# Altium project DS-1+.PrjPcb
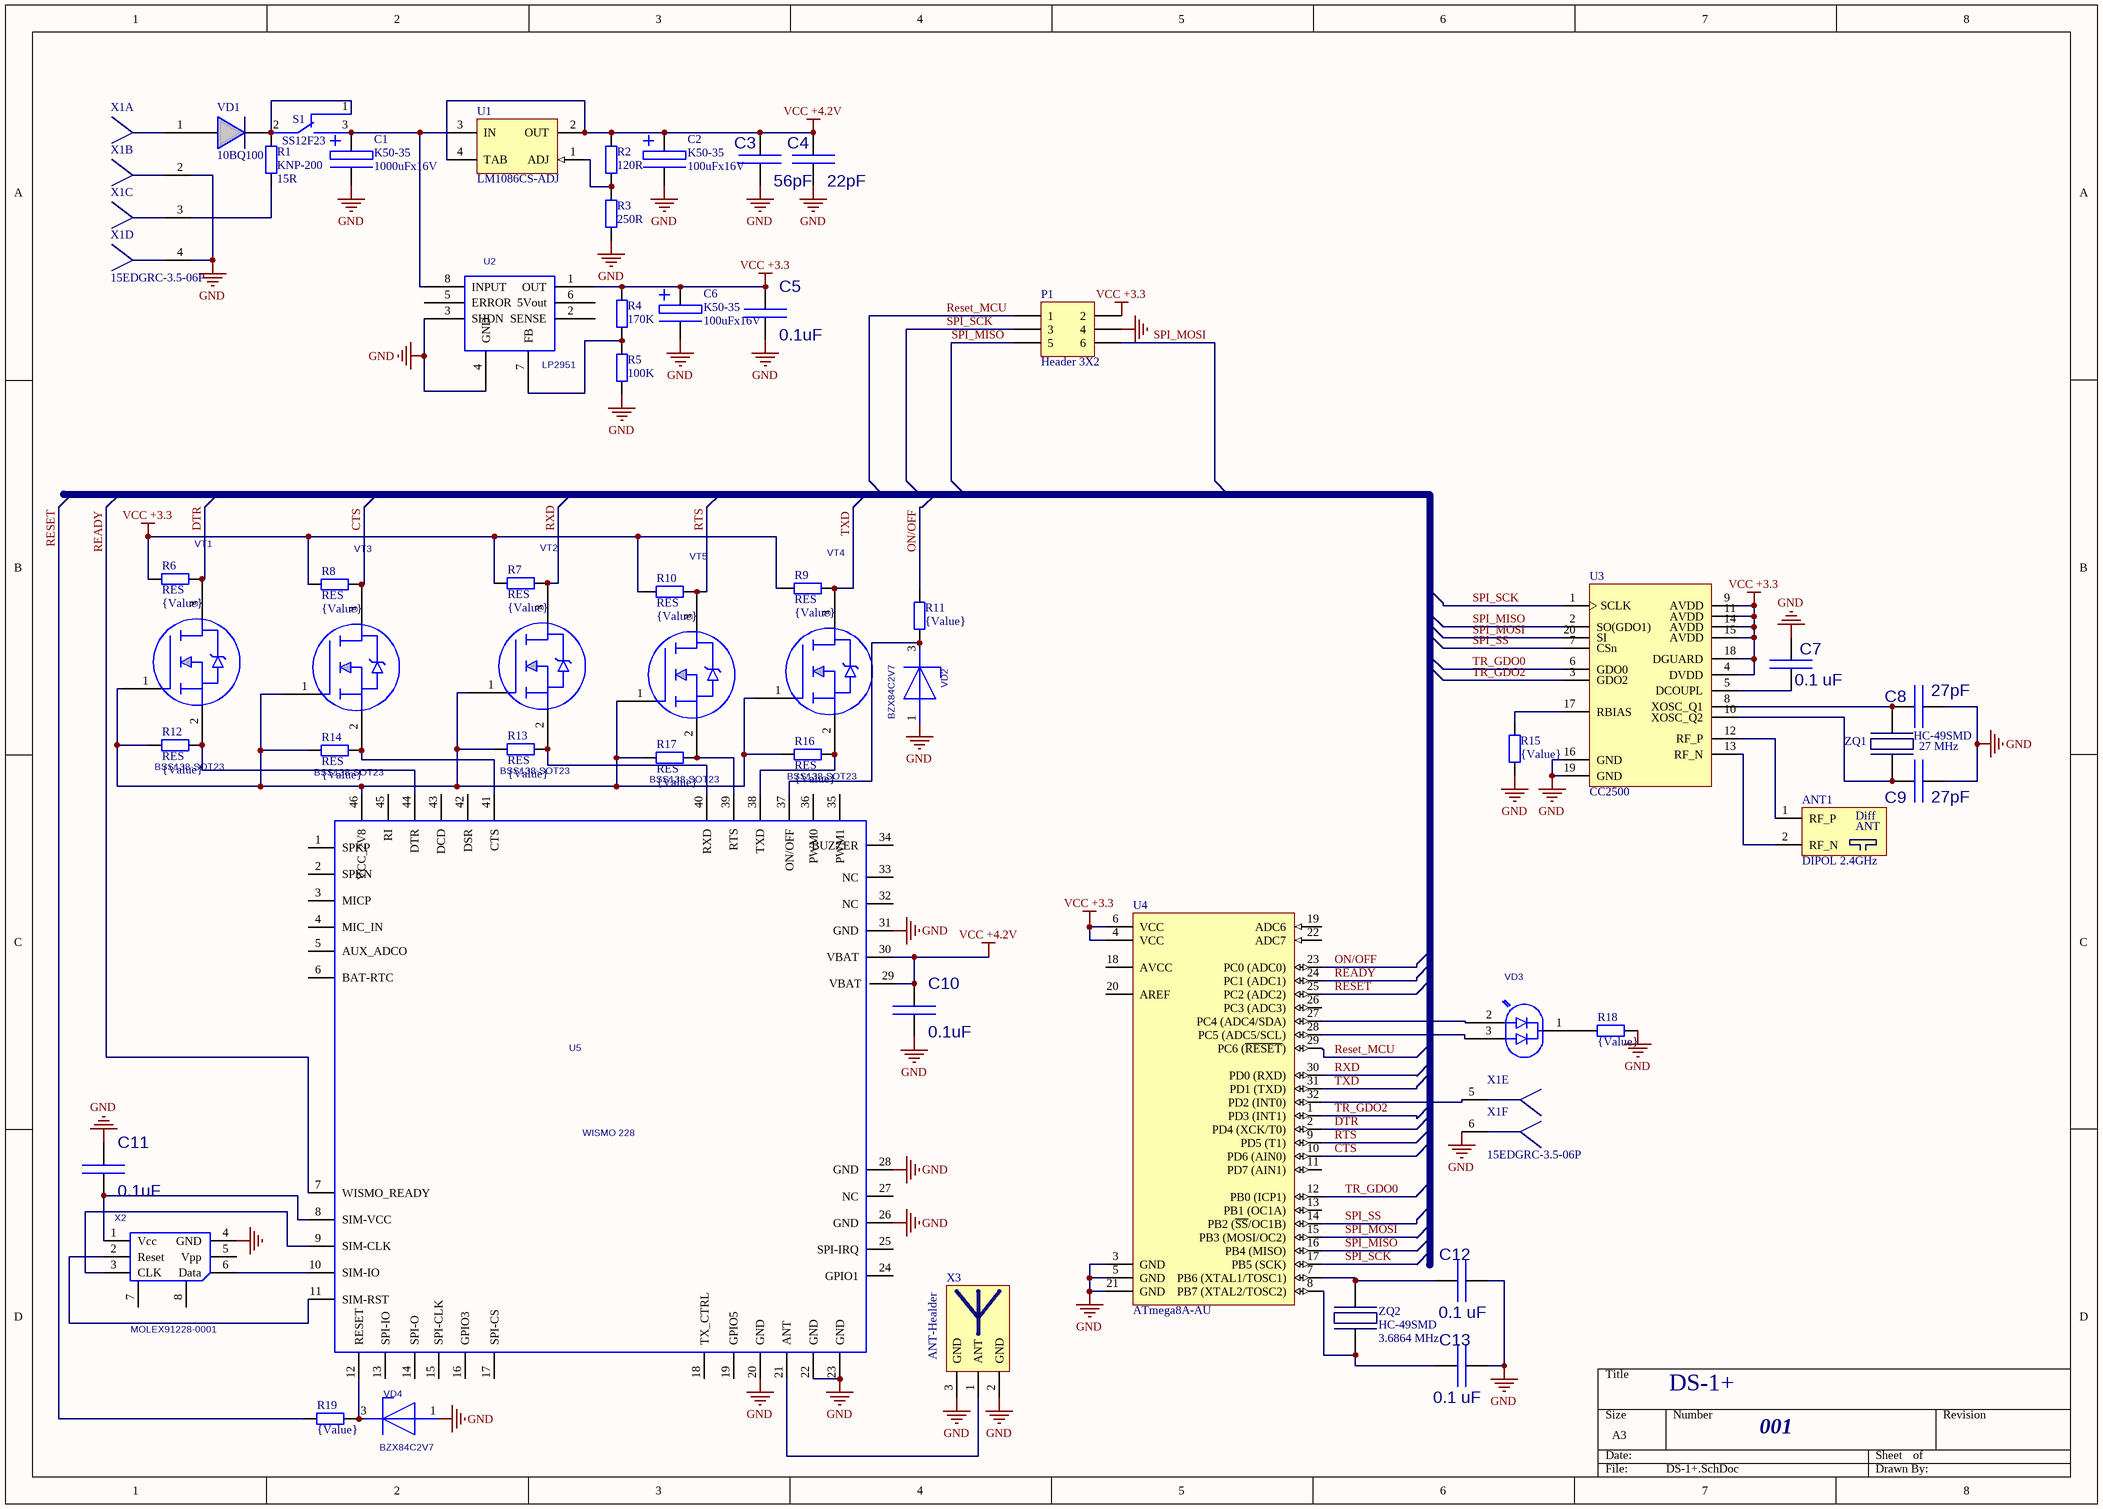
[diagram p0: DS-1+.SchDoc]
1 sheet, 54 parts. Net scope: global (net labels, ports and power ports of the same name join across sheets).
Board file: DS-1+.PcbDoc

## Sheet DS-1+.SchDoc
size A3

### Parts
ANT1  DIPOL 2.4GHz  [ANT_Dipol_2.4GHz]
C1  K50-35  value 1000uFx16V  [CAP_POL_D10]
C2  K50-35  value 100uFx16V  [CAP_POL_D6.3]
C3  value 56pF  [C0805]  (hidden comment: KONDENS_SMD)
C4  value 22pF  [C0805]  (hidden comment: KONDENS_SMD)
C5  value 0.1uF  [C0805]  (hidden comment: KONDENS_SMD)
C6  K50-35  value 100uFx16V  [CAP_POL_D6.3]
C7  value 0.1 uF  [C0805]  (hidden comment: KONDENS_SMD)
C8  value 27pF  [C0805]  (hidden comment: KONDENS_SMD)
C9  value 27pF  [C0805]  (hidden comment: KONDENS_SMD)
C10  value 0.1uF  [C0805]  (hidden comment: KONDENS_SMD)
C11  value 0.1uF  [C0805]  (hidden comment: KONDENS_SMD)
C12  value 0.1 uF  [C0805]  (hidden comment: KONDENS_SMD)
C13  value 0.1 uF  [C0805]  (hidden comment: KONDENS_SMD)
P1  Header 3X2  [HDR2X3]
R1  KNP-200  value 15R  [Resistor KNP-200]
R2  value 120R  [C0805]  (hidden comment: RES)
R3  value 250R  [C0805]  (hidden comment: RES)
R4  value 170K  [C0805]  (hidden comment: RES)
R5  value 100K  [C0805]  (hidden comment: RES)
R6  RES  value {Value}  [C0805]
R7  RES  value {Value}  [C0805]
R8  RES  value {Value}  [C0805]
R9  RES  value {Value}  [C0805]
R10  RES  value {Value}  [C0805]
R11  value {Value}  [C0805]  (hidden comment: RES)
R12  RES  value {Value}  [C0805]
R13  RES  value {Value}  [C0805]
R14  RES  value {Value}  [C0805]
R15  value {Value}  [C0805]  (hidden comment: RES)
R16  RES  value {Value}  [C0805]
R17  RES  value {Value}  [C0805]
R18  value {Value}  [C0805]  (hidden comment: RES)
R19  value {Value}  [C0805]  (hidden comment: RES)
S1  SS12F23  [SS12F23]
U1  LM1086CS-ADJ  [TS3B_M]
U2  LP2951  [SOIC-8]
U3  CC2500  [VQFN20]
U4  ATmega8A-AU  [32A_M]
U5  WISMO 228  [WISMO]
VD1  10BQ100  [SMB]
VD2  BZX84C2V7  [SOT23]
VD3  LIGHTDIODE2  [LIGHTDIODE2]  (value not drawn)
VD4  BZX84C2V7  [SOT23]
VT1  BSS138-SOT23  [SOT23]
VT2  BSS138-SOT23  [SOT23]
VT3  BSS138-SOT23  [SOT23]
VT4  BSS138-SOT23  [SOT23]
VT5  BSS138-SOT23  [SOT23]
X1  15EDGRC-3.5-06P  [15EDGRC-3.5-06P]  (value not drawn)  (parts A,B,C,D,E,F of 6)
X2  MOLEX91228-0001  [MOLEX91228-0001]
X3  ANT-Healder  [ANT-Healder]
ZQ1  HC-49SMD  value 27 MHz  [HC-49SMD]
ZQ2  HC-49SMD  value 3.6864 MHz  [HC-49SMD]

### Nets
GND: C1.2(MINUS) C2.2(MINUS) C3.2(B) C4.2(B) C5.2(B) C6.2(MINUS) C7.2(B) C8.2(B) C9.2(B) C10.2(B) C11.1(A) C12.2(B) C13.2(B) P1.4 R3.1 R5.1 R15.1 R18.2 U2.3(SHDN) U2.4(GND) U3.16(GND) U3.19(GND) U4.3(GND) U4.5(GND) U4.21(GND) U5.20(GND) U5.22(GND) U5.23(GND) U5.26(GND) U5.28(GND) U5.31(GND) VD2.1 VD4.1 X1.2 X1.4 X1.6 X2.4(GND) X3.2(GND) X3.3(GND)
VCC +3.3: C5.1(A) C6.1(PLUS) P1.2 R4.2 R6.1 R7.1 R8.1 R9.1 R10.1 U2.1(OUT) U3.4(DVDD) U3.9(AVDD) U3.11(AVDD) U3.14(AVDD) U3.15(AVDD) U3.18(DGUARD) U4.4(VCC) U4.6(VCC)
VCC +4.2V: C2.1(PLUS) C3.1(A) C4.1(A) C10.1(A) R2.2 U1.2(OUT) U1.4(TAB) U5.29(VBAT) U5.30(VBAT)
CTS: R8.2 U4.10(PD6_(AIN0)) VT3.3(Drain)
DTR: R6.2 U4.2(PD4_(XCK/T0)) VT1.3(Drain)
ON/OFF: R11.2 U4.23(PC0_(ADC0))
READY: U4.24(PC1_(ADC1)) U5.7(WISMO_READY)
RESET: R19.1 U4.25(PC2_(ADC2))
Reset_MCU: P1.1 U4.29(PC6_(~{RESET}))
RTS: R10.2 U4.9(PD5_(T1)) VT5.3(Drain)
RXD: R7.2 U4.30(PD0_(RXD)) VT2.3(Drain)
SPI_MISO: P1.5 U3.2(SO(GDO1)) U4.16(PB4_(MISO))
SPI_MOSI: P1.6 U3.20(SI) U4.15(PB3_(MOSI/OC2))
SPI_SCK: P1.3 U3.1(SCLK) U4.17(PB5_(SCK))
SPI_SS: U3.7(CSn) U4.14(PB2_(~{SS}/OC1B))
TR_GDO0: U3.6(GDO0) U4.12(PB0_(ICP1))
TR_GDO2: U3.3(GDO2) U4.1(PD3_(INT1))
TXD: R9.2 U4.31(PD1_(TXD)) VT4.3(Drain)
NetANT1_1: ANT1.1(RF_P) U3.12(RF_P)
NetANT1_2: ANT1.2(RF_N) U3.13(RF_N)
NetC1_1: C1.1(PLUS) S1.3 U1.3(IN) U2.8(INPUT)
NetC7_1: C7.1(A) U3.5(DCOUPL)
NetC8_1: C8.1(A) U3.8(XOSC_Q1) ZQ1.1
NetC9_1: C9.1(A) U3.10(XOSC_Q2) ZQ1.2
NetC11_2: C11.2(B) U5.8(SIM-VCC) X2.1(Vcc)
NetC12_1: C12.1(A) U4.7(PB6_(XTAL1/TOSC1)) ZQ2.1
NetC13_1: C13.1(A) U4.8(PB7_(XTAL2/TOSC2)) ZQ2.2
NetR1_1: R1.1 X1.3
NetR1_2: R1.2 S1.1 S1.2 VD1.1
NetR2_1: R2.1 R3.2 U1.1(ADJ)
NetR4_1: R4.1 R5.2 U2.7(FB)
NetR11_1: R11.1 U5.37(ON/OFF) VD2.3
NetR12_1: R12.1 R13.1 R14.1 R16.1 R17.1 U5.46(VCC_2V8) VT1.1(Gate) VT2.1(Gate) VT3.1(Gate) VT4.1(Gate) VT5.1(Gate)
NetR12_2: R12.2 U5.44(DTR) VT1.2(Source)
NetR13_2: R13.2 U5.40(RXD) VT2.2(Source)
NetR14_2: R14.2 U5.41(CTS) VT3.2(Source)
NetR15_2: R15.2 U3.17(RBIAS)
NetR16_2: R16.2 U5.38(TXD) VT4.2(Source)
NetR17_2: R17.2 U5.39(RTS) VT5.2(Source)
NetR18_1: R18.1 VD3.1
NetR19_2: R19.2 U5.12(RESET) VD4.3
NetU4_27: U4.27(PC4_(ADC4/SDA)) VD3.2
NetU4_28: U4.28(PC5_(ADC5/SCL)) VD3.3
NetU4_32: U4.32(PD2_(INT0)) X1.5
NetU5_9: U5.9(SIM-CLK) X2.3(CLK)
NetU5_10: U5.10(SIM-IO) X2.6(Data)
NetU5_11: U5.11(SIM-RST) X2.2(Reset)
NetU5_21: U5.21(ANT) X3.1(ANT)
NetVD1_2: VD1.2 X1.1

Not connected (* = marked no-connect by the designer): U2 2(SENSE) 5(ERROR) 6(5Vout); U4 11(PD7_(AIN1)) 13(PB1_(OC1A)) 18(AVCC) 19(ADC6) 20(AREF) 22(ADC7) 26(PC3_(ADC3)); U5 1(SPKP) 2(SPKN) 3(MICP) 4(MIC_IN) 5(AUX_ADCO) 6(BAT-RTC) 13(SPI-IO) 14(SPI-O) 15(SPI-CLK) 16(GPIO3) 17(SPI-CS) 18(TX_CTRL) 19(GPIO5) 24(GPIO1) 25(SPI-IRQ) 27(NC) 32(NC) 33(NC) 34(BUZZER) 35(PWM1) 36(PWM0) 42(DSR) 43(DCD) 45(RI); VD2 2; VD4 2; X2 5(Vpp) 7(0) 8(1)

### Notes on the sheet
- DS-1+
- 001
- (in symbol ANT_dipol_2.4GHz) Diff; ANT

### Library data of the parts
ANT1 = ANT_dipol_2.4GHz
C1 = Capasitor_pol D10
C2 C6 = Capasitor_pol D6.3
P1 = Header 3X2: Header, 3-Pin, Dual row; LatestRevisionDate: 17-Jul-2002; LatestRevisionNote: Re-released for DXP Platform.; Publisher: Altium Limited
R1 = Resistor 2W
R2-R19 = RES: Resistor
U1 = LM1086CS-ADJ: 1.5A Low Dropout Positive Regulators, 3-pin TO-263; Manufacturer: National Semiconductor; PackageTopMarking: NSUZXYTTE#*LM1086*CS-ADJ; PowerWise: N; CompType: LDO IC; Published: 4-Dec-2008; DatasheetVersion: Jun-2005; PackageVersion: revF, Apr-2005; PackageReference: TS3B; Publisher: Altium Limited; PackageDescription: TO-263, Molded, .400 x .390 x .180in, 3 Lead, .1in Pitch, Surface Mount; Supplier 1: Farnell; Supplier Part Number 1: 9489975; PartNumber: LM1086CS-ADJ; RoHS: N; PinCount: 3; Code_JEDEC: MO-169-AA; ComponentLink1Description: LM1086 Datasheet; ComponentLink1URL: http://www.national.com/ds/LM/LM1086.pdf; ComponentLink2Description: LM1086 Web Page; ComponentLink2URL: http://www.national.com/pf/LM/LM1086.html; ComponentLink3Description: TS3B Package Page; ComponentLink3URL: http://www.national.com/packaging/folders/ts3b.html
U4 = ATmega8A-AU: 8-bit AVR Microcontroller, 8KB Flash, 512 Bytes EEPROM, 1KB SRAM, 32-pin TQFP, Industrial Grade (-40°C to 85°C); Published: 1-Apr-2010; DatasheetVersion: revC, Jul-2009; PackageVersion: revB, Oct-2001; PackageReference: 32A; Publisher: Altium Limited; PackageDescription: 32-Lead, 7x7x1.0 mm Body, 0.8mm Lead Pitch, Thin Profile Plastic Quad Flat Package (TQFP); Supplier 1: Digi-Key; Supplier Part Number 1: ATMEGA8A-AU-ND; Supplier 2: Farnell; Supplier Part Number 2: 1748532; Supplier 3: Mouser; Supplier Part Number 3: 556-ATMEGA8A-AU; Code_JEDEC: MS-026-ABA; ComponentLink1Description: Manufacturer Link; ComponentLink1URL: http://www.atmel.com/products/avr/default.asp?; ComponentLink2Description: ATmega8A Datasheet; ComponentLink2URL: http://www.atmel.com/dyn/resources/prod_documents/doc8159.pdf; ComponentLink3Description: ATmega8A Summary; ComponentLink3URL: http://www.atmel.com/dyn/resources/prod_documents/8159S.pdf; ComponentLink4Description: Atmel.com Home; ComponentLink4URL: http://www.atmel.com
X3 = ANT_HELDER
U2 = LP2951: Value: *
U5 = WISMO 228: Value: *
VD2 VD4 = BZX84C2V7: Value: *
VD3 = LIGHTDIODE2: Value: *
VT1-VT5 = BSS138-SOT23: Value: *
X2 = MOLEX91228-0001: Value: *